# Altium schematic sheet Power_Distribution_2021_5V.SchDoc
size A; SheetNumber: 4; SheetTotal: 4
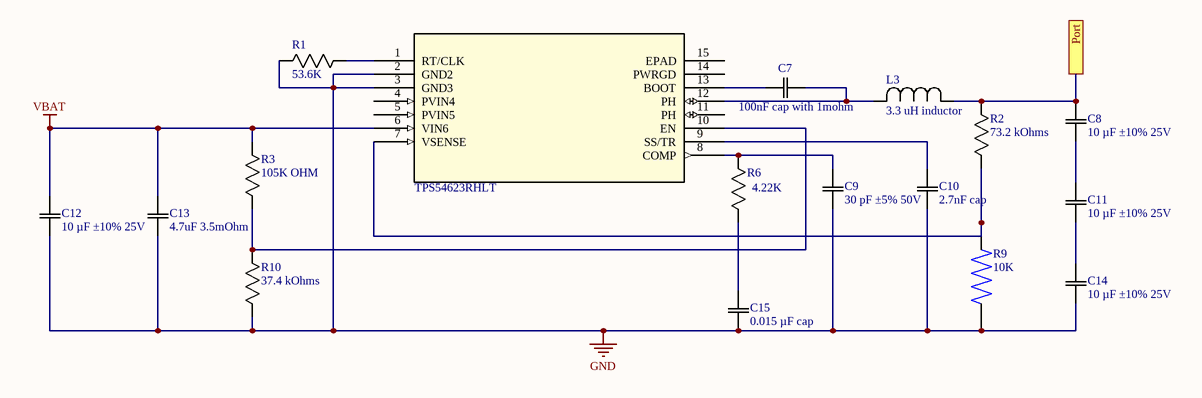
[diagram p0: Power_Distribution_2021_5V.SchDoc]

## Parts
*  TPS54623RHLT
C7  100nF cap with 1mohm
C8  10 µF ±10% 25V
C9  30 pF ±5% 50V
C10  2.7nF cap
C11  10 µF ±10% 25V
C12  10 µF ±10% 25V
C13  4.7uF 3.5mOhm
C14  10 µF ±10% 25V
C15  0.015 µF cap
L3  3.3 uH inductor
R1  53.6K
R2  73.2 kOhms
R3  105K OHM
R6  4.22K
R9  10K  [RESC3216X65N]
R10  37.4 kOhms

## Ports
Port

## Nets
GND: *.2(GND2) *.3(GND3) C9.1 C10.1 C12.1 C13.1 C14.1 C15.1 R1.1 R9.1 R10.2
VBAT: *.6(VIN6) C12.2 C13.2 R3.1
Port: C8.2 L3.1 R2.1 ; port Port
Net*_1: *.1(RT/CLK) R1.2
Net*_7: *.7(VSENSE) R2.2 R9.2
Net*_8: *.8(COMP) C9.2 R6.1
Net*_9: *.9(SS/TR) C10.2
Net*_10: *.10(EN) R3.2 R10.1
Net*_12: *.12(PH) C7.2 L3.2
Net*_13: *.13(BOOT) C7.1
NetC8_1: C8.1 C11.2
NetC11_1: C11.1 C14.2
NetC15_2: C15.2 R6.2

Not connected (* = marked no-connect by the designer): * 4(PVIN4) 5(PVIN5) 11(PH) 14(PWRGD) 15(EPAD)

## Library data of the parts
* = TPS54623RHLT: Conv DC-DC 4.5V to 17V Synchronous Step Down Single-Out 0.6V to 15V 6A 14-Pin VQFN EP T/R; Manufacturer: Texas Instruments; Switching Frequency: 1.6MHz; Number of Outputs: 1; Synchronous Rectifier: Yes; Min Output Voltage: 600mV; Quiescent Current: 250uA; Output Type: Adjustable; Supplier 1: Digi-Key; Manufacturer Part Number: TPS54623RHLT; RoHS: Yes; Category: Voltage Regulators - Switching; Pricing 1: 1=4.23000, 10=3.79900, 25=3.59200, 100=3.11290 (USD); Mount: Surface Mount; Case/Package: VQFN; Number of Pins: 14; Min Operating Temperature: -40°C; Max Operating Temperature: 150°C; Output Voltage: 15V; Output Current: 6A; Max Input Voltage: 17V; Min Input Voltage: 4.5V; Packaging: Tape and Reel; Package Quantity: 1; Max Output Current: 6A; Max Output Voltage: 15V; Operating Supply Voltage: 17V; Series: SWIFT™; Length: 3.65mm; Width: 3.65mm; Height: 0.95mm; Radiation Hardening: No; REACH SVHC: No SVHC; Lead Free: Lead Free; RoHS Compliant: Yes; ComponentLink1URL: https://datasheet.ciiva.com/2026/tps54623-2026704.pdf?src-supplier=Digi-Key; ComponentLink1Description: https://datasheet.ciiva.com/2026/tps54623-2026704.pdf?src-supplier=Digi-Key; ComponentLink2URL: https://datasheet.ciiva.com/25627/0900766b810d1a6a-25627230.pdf?src-supplier=RSComponents; ComponentLink2Description: https://datasheet.ciiva.com/25627/0900766b810d1a6a-25627230.pdf?src-supplier=RSComponents; ComponentLink3URL: https://datasheet.ciiva.com/7462/1496171-7462267.pdf?src-supplier=Newark; ComponentLink3Description: https://datasheet.ciiva.com/7462/1496171-7462267.pdf?src-supplier=Newark; ComponentLink4URL: https://datasheet.ciiva.com/2026/tps54623-2026702.pdf?src-supplier=Digi-Key; ComponentLink4Description: https://datasheet.ciiva.com/2026/tps54623-2026702.pdf?src-supplier=Digi-Key; ComponentLink5URL: https://datasheet.ciiva.com/2026/tps54623-2026703.pdf?src-supplier=Digi-Key; ComponentLink5Description: https://datasheet.ciiva.com/2026/tps54623-2026703.pdf?src-supplier=Digi-Key; ComponentLink6URL: https://datasheet.ciiva.com/7993/1882170-7993893.pdf?src-supplier=Element14; ComponentLink6Description: https://datasheet.ciiva.com/7993/1882170-7993893.pdf?src-supplier=Element14; Supplier Part Number 1: 296-29679-1-ND
C7 = C0603C104Z3VACTU: KEMET - C0603C104Z3VACTU - Multilayer Ceramic Capacitor, C Series, 0.1 - F, +80%, -20%, Y5V, 25 V, 0603 [1608 Metric] RoHS Compliant: Yes; Tolerance: 80%; Voltage Rating: 25V; Dissipation Factor: 7%; Supplier 1: Digi-Key; Manufacturer: KEMET; Manufacturer Part Number: C0603C104Z3VACTU; RoHS: Yes; Category: Ceramic Capacitors; Stock 1: 811115; Pricing 1: 1=0.10000, 10=0.02900, 50=0.01580, 100=0.01300, 500=0.00926, 1000=0.00727 (USD); Mount: Surface Mount,PCB; Case/Package: 0603; Number of Pins: 2; Case Code (Metric): 1608; Case Code (Imperial): 0603; Dielectric Material: Ceramic; Min Operating Temperature: -30°C; Max Operating Temperature: 85°C; Capacitance: 100nF; Packaging: Tape and Reel; Voltage Rating (DC): 25V; Package Quantity: 1; Dielectric: Y5V; Termination: SMD/SMT; Voltage: 25V; Series: C; Construction: Flat; Length: 1.6mm; Width: 0.031inch; Height: 0.8mm; Thickness: 0.034inch; Lead Pitch: 0.7mm; Depth: 0.8mm; Radiation Hardening: No; REACH SVHC: No SVHC; Lead Free: Lead Free; RoHS Compliant: Yes; ComponentLink1URL: https://datasheet.ciiva.com/46443/1828802-46443708.pdf?src-supplier=Element14; ComponentLink1Description: https://datasheet.ciiva.com/46443/1828802-46443708.pdf?src-supplier=Element14; ComponentLink2URL: https://datasheet.ciiva.com/46443/1828802-46443709.pdf?src-supplier=Element14; ComponentLink2Description: https://datasheet.ciiva.com/46443/1828802-46443709.pdf?src-supplier=Element14; ComponentLink3URL: https://datasheet.ciiva.com/7823/1470417-7823994.pdf?src-supplier=Element14; ComponentLink3Description: https://datasheet.ciiva.com/7823/1470417-7823994.pdf?src-supplier=Element14; Supplier Part Number 1: 399-1100-1-ND
C8 C11 C12 C14 = GRM31CR71E106KA12L: MURATA - GRM31CR71E106KA12L - SMD Multilayer Ceramic Capacitor, 10 µF, 25 V, 1206 [3216 Metric], ± 10%, X7R, GRM Series; Capacitance: 10uF; Supplier 1: Digi-Key; Manufacturer: Murata; Manufacturer Part Number: GRM31CR71E106KA12L; RoHS: Yes; Category: Ceramic Capacitors; Stock 1: 156029; Pricing 1: 1=0.70000, 10=0.51300, 50=0.41020, 100=0.35160, 500=0.27838, 1000=0.23443 (USD); Mount: Surface Mount; Case/Package: 1206; Number of Pins: 2; Case Code (Imperial): 1206; Case Code (Metric): 3216; Material: Ceramic; Min Operating Temperature: -55°C; Max Operating Temperature: 125°C; Tolerance: 10%; Dielectric: X7R; Voltage Rating: 25V; Voltage Rating (DC): 25V; Packaging: Tape and Reel; Package Quantity: 1; Termination: SMD/SMT; Voltage: 25V; Series: GRM; Construction: Flat; Length: 3.2mm; Width: 1.6mm; Height: 1.6mm; Thickness: 0.071inch; Depth: 1.6mm; Radiation Hardening: No; REACH SVHC: No SVHC; Lead Free: Lead Free; RoHS Compliant: Yes; ComponentLink1URL: https://datasheet.ciiva.com/5418/product-5418961.pdf?src-supplier=Mouser; ComponentLink1Description: https://datasheet.ciiva.com/5418/product-5418961.pdf?src-supplier=Mouser; ComponentLink2URL: https://datasheet.ciiva.com/3777/4378grm31cr71e106ka1223-3777275.pdf?src-supplier=Arrow+Electronics; ComponentLink2Description: https://datasheet.ciiva.com/3777/4378grm31cr71e106ka1223-3777275.pdf?src-supplier=Arrow+Electronics; ComponentLink3URL: https://datasheet.ciiva.com/22746/415311-22746465.pdf?src-supplier=Element14; ComponentLink3Description: https://datasheet.ciiva.com/22746/415311-22746465.pdf?src-supplier=Element14; ComponentLink4URL: https://datasheet.ciiva.com/11789/0900766b80ef921d-11789064.pdf?src-supplier=RSComponents; ComponentLink4Description: https://datasheet.ciiva.com/11789/0900766b80ef921d-11789064.pdf?src-supplier=RSComponents; ComponentLink5URL: https://datasheet.ciiva.com/22703/1747484-22703378.pdf?src-supplier=Element14; ComponentLink5Description: https://datasheet.ciiva.com/22703/1747484-22703378.pdf?src-supplier=Element14; ComponentLink6URL: https://datasheet.ciiva.com/29199/454935-da-01-en-vs-kondensator-1206-29199424.pdf?src-supplier=Conrad; ComponentLink6Description: https://datasheet.ciiva.com/29199/454935-da-01-en-vs-kondensator-1206-29199424.pdf?src-supplier=Conrad; ComponentLink7URL: https://datasheet.ciiva.com/29202/451104-da-01-de-vs-chip-kond-1206-10-0-uf-10pr-25-0v-x7r-29202596.pdf?src-supplier=Conrad; ComponentLink7Description: https://datasheet.ciiva.com/29202/451104-da-01-de-vs-chip-kond-1206-10-0-uf-10pr-25-0v-x7r-29202596.pdf?src-supplier=Conrad; ComponentLink8URL: https://datasheet.ciiva.com/22774/415311-22774043.pdf?src-supplier=Farnell; ComponentLink8Description: https://datasheet.ciiva.com/22774/415311-22774043.pdf?src-supplier=Farnell; ComponentLink9URL: https://datasheet.ciiva.com/22774/415311-22774044.pdf?src-supplier=Farnell; ComponentLink9Description: https://datasheet.ciiva.com/22774/415311-22774044.pdf?src-supplier=Farnell; ComponentLink10URL: https://datasheet.ciiva.com/6264/partnumbering-e-01-6264458.pdf?src-supplier=Digi-Key; ComponentLink10Description: https://datasheet.ciiva.com/6264/partnumbering-e-01-6264458.pdf?src-supplier=Digi-Key; ComponentLink11URL: https://datasheet.ciiva.com/6264/partnumbering-e-01-6264460.pdf?src-supplier=Digi-Key; ComponentLink11Description: https://datasheet.ciiva.com/6264/partnumbering-e-01-6264460.pdf?src-supplier=Digi-Key; ComponentLink12URL: https://datasheet.ciiva.com/6264/partnumbering-e-01-6264462.pdf?src-supplier=Digi-Key; ComponentLink12Description: https://datasheet.ciiva.com/6264/partnumbering-e-01-6264462.pdf?src-supplier=Digi-Key; ComponentLink13URL: https://datasheet.ciiva.com/16210/partnumbering-e-01-16210776.pdf?src-supplier=Future+Electronics; ComponentLink13Description: https://datasheet.ciiva.com/16210/partnumbering-e-01-16210776.pdf?src-supplier=Future+Electronics; ComponentLink14URL: https://datasheet.ciiva.com/14116/grmseries-highdielectrictype-eng-14116377.pdf?src-supplier=Distrelec; ComponentLink14Description: https://datasheet.ciiva.com/14116/grmseries-highdielectrictype-eng-14116377.pdf?src-supplier=Distrelec; Supplier Part Number 1: 490-6518-1-ND
C9 = CL21C300JBANNNC: Cap Ceramic 30pF 50V C0G 5% Pad SMD 0805 125C T/R; Manufacturer: Samsung; Temperature Coefficient: 300ppm/°C; Supplier 1: Digi-Key; Manufacturer Part Number: CL21C300JBANNNC; RoHS: Yes; Category: Ceramic Capacitors; Stock 1: 76739; Pricing 1: 1=0.10000, 10=0.04800, 50=0.02600, 100=0.02120, 500=0.01512, 1000=0.01188 (USD); Mount: Surface Mount; Case/Package: 0805; Case Code (Metric): 2012; Case Code (Imperial): 0805; Min Operating Temperature: -55°C; Max Operating Temperature: 125°C; Capacitance: 30pF; Tolerance: 5%; Dielectric: C0G; Package Quantity: 1; Packaging: Tape and Reel; Voltage Rating: 50V; Voltage: 50V; Series: CL; Construction: Flat; Length: 2mm; Width: 0.049inch; Height: 0.65mm; Depth: 1.25mm; Thickness: 0.03inch; Radiation Hardening: No; RoHS Compliant: Yes; ComponentLink1URL: https://datasheet.ciiva.com/26878/getdatasheetpartid-664450-26878150.pdf?src-supplier=Verical; ComponentLink1Description: https://datasheet.ciiva.com/26878/getdatasheetpartid-664450-26878150.pdf?src-supplier=Verical; ComponentLink2URL: https://datasheet.ciiva.com/16428/cl21c020bbannnc-16428903.pdf?src-supplier=Future+Electronics; ComponentLink2Description: https://datasheet.ciiva.com/16428/cl21c020bbannnc-16428903.pdf?src-supplier=Future+Electronics; Supplier Part Number 1: 1276-1130-1-ND
C10 = C2012C0G1H272J060AA: Cap Ceramic 0.0027uF 50V C0G 5% SMD 0805 125C Paper T/R; Manufacturer: TDK; Temperature Coefficient: 30ppm/°C; Supplier 1: Digi-Key; Manufacturer Part Number: C2012C0G1H272J060AA; RoHS: Yes; Category: Ceramic Capacitors; Stock 1: 49370; Pricing 1: 1=0.22000, 10=0.15400, 50=0.08760, 100=0.07250, 500=0.05086, 1000=0.04210 (USD); Mount: Surface Mount; Case/Package: 0805; Case Code (Imperial): 0805; Case Code (Metric): 2012; Weight: 0.000194oz; Dielectric Material: Ceramic; Min Operating Temperature: -55°C; Max Operating Temperature: 125°C; Packaging: Tape and Reel; Capacitance: 2.7nF; Voltage Rating: 50V; Tolerance: 5%; Voltage Rating (DC): 50V; Termination: SMD/SMT; Construction: Flat; Package Quantity: 1; Dielectric: C0G; Voltage: 50V; Series: C; Length: 2mm; Width: 1.25mm; Height: 0.6mm; Thickness: 0.028inch; Depth: 1.25mm; Radiation Hardening: No; RoHS Compliant: Yes; Lead Free: Lead Free; ComponentLink1URL: https://datasheet.ciiva.com/24219/c2012c0g1h272j060aa-264945-24219106.pdf?src-supplier=Mouser; ComponentLink1Description: https://datasheet.ciiva.com/24219/c2012c0g1h272j060aa-264945-24219106.pdf?src-supplier=Mouser; ComponentLink2URL: https://datasheet.ciiva.com/11788/0900766b80c1bb00-11788104.pdf?src-supplier=RSComponents; ComponentLink2Description: https://datasheet.ciiva.com/11788/0900766b80c1bb00-11788104.pdf?src-supplier=RSComponents; ComponentLink3URL: https://datasheet.ciiva.com/26936/getdatasheetpartid-781773-26936472.pdf?src-supplier=Verical; ComponentLink3Description: https://datasheet.ciiva.com/26936/getdatasheetpartid-781773-26936472.pdf?src-supplier=Verical; ComponentLink4URL: https://datasheet.ciiva.com/6291/tdkmlcccaprange-6291704.pdf?src-supplier=Digi-Key; ComponentLink4Description: https://datasheet.ciiva.com/6291/tdkmlcccaprange-6291704.pdf?src-supplier=Digi-Key; ComponentLink5URL: https://datasheet.ciiva.com/6291/tdkmlcccaprange-6291707.pdf?src-supplier=Digi-Key; ComponentLink5Description: https://datasheet.ciiva.com/6291/tdkmlcccaprange-6291707.pdf?src-supplier=Digi-Key; ComponentLink6URL: https://datasheet.ciiva.com/6291/tdkmlcccaprange-6291710.pdf?src-supplier=Digi-Key; ComponentLink6Description: https://datasheet.ciiva.com/6291/tdkmlcccaprange-6291710.pdf?src-supplier=Digi-Key; Supplier Part Number 1: 445-7508-1-ND
C13 = GRM31CR71H475KA12L: 1206 4.7 uF 50 V ±10% Tolerance X7R SMT Multilayer Ceramic Capacitor; Manufacturer: Murata; Voltage Rating: 50V; Supplier 1: Digi-Key; Manufacturer Part Number: GRM31CR71H475KA12L; RoHS: Yes; Category: Ceramic Capacitors; Stock 1: 47542; Pricing 1: 1=0.46000, 10=0.31700, 50=0.22160, 100=0.19000, 500=0.14250, 1000=0.12033 (USD); Mount: Surface Mount; Case/Package: 1206; Case Code (Metric): 3216; Case Code (Imperial): 1206; Material: Ceramic; Min Operating Temperature: -55°C; Max Operating Temperature: 125°C; Capacitance: 4.7uF; Tolerance: 10%; Dielectric: X7R; Packaging: Tape and Reel; Voltage Rating (DC): 50V; Package Quantity: 2000; Termination: SMD/SMT; Voltage: 50V; Series: GRM; Construction: Flat; Length: 3.2mm; Width: 0.063inch; Height: 1.6mm; Thickness: 0.071inch; Depth: 1.6mm; Radiation Hardening: No; REACH SVHC: No SVHC; Lead Free: Lead Free; RoHS Compliant: Yes; ComponentLink1URL: https://datasheet.ciiva.com/6072/415379-6072784.pdf?src-supplier=Farnell; ComponentLink1Description: https://datasheet.ciiva.com/6072/415379-6072784.pdf?src-supplier=Farnell; ComponentLink2URL: https://datasheet.ciiva.com/3777/2267grm31cr71h475ka1223-3777241.pdf?src-supplier=Arrow+Electronics; ComponentLink2Description: https://datasheet.ciiva.com/3777/2267grm31cr71h475ka1223-3777241.pdf?src-supplier=Arrow+Electronics; ComponentLink3URL: https://datasheet.ciiva.com/29202/451279-da-01-de-vs-kondens-grm31-cr71h-475ka12l-29202365.pdf?src-supplier=Conrad; ComponentLink3Description: https://datasheet.ciiva.com/29202/451279-da-01-de-vs-kondens-grm31-cr71h-475ka12l-29202365.pdf?src-supplier=Conrad; ComponentLink4URL: https://datasheet.ciiva.com/29202/450972-da-01-de-vs-chip-kond-1206-4-7-uf-10pr-50-0v-x7r-29202576.pdf?src-supplier=Conrad; ComponentLink4Description: https://datasheet.ciiva.com/29202/450972-da-01-de-vs-chip-kond-1206-4-7-uf-10pr-50-0v-x7r-29202576.pdf?src-supplier=Conrad; ComponentLink5URL: https://datasheet.ciiva.com/6270/partnumbering-e-01-6270217.pdf?src-supplier=Digi-Key; ComponentLink5Description: https://datasheet.ciiva.com/6270/partnumbering-e-01-6270217.pdf?src-supplier=Digi-Key; ComponentLink6URL: https://datasheet.ciiva.com/6270/partnumbering-e-01-6270218.pdf?src-supplier=Digi-Key; ComponentLink6Description: https://datasheet.ciiva.com/6270/partnumbering-e-01-6270218.pdf?src-supplier=Digi-Key; ComponentLink7URL: https://datasheet.ciiva.com/6270/partnumbering-e-01-6270219.pdf?src-supplier=Digi-Key; ComponentLink7Description: https://datasheet.ciiva.com/6270/partnumbering-e-01-6270219.pdf?src-supplier=Digi-Key; ComponentLink8URL: https://datasheet.ciiva.com/7937/415310-7937749.pdf?src-supplier=Element14; ComponentLink8Description: https://datasheet.ciiva.com/7937/415310-7937749.pdf?src-supplier=Element14; Supplier Part Number 1: 490-6521-1-ND
C15 = CGA4F2C0G1H153J085AA: SMD Multilayer Ceramic Capacitor, CGA Series, 0.015 F, 5%, C0G / NP0, 50 V, 0805 [2012 Metric] ;RoHS Compliant: Yes; Manufacturer: TDK; Capacitance: 15nF; Voltage Rating: 50V; Supplier 1: Digi-Key; Manufacturer Part Number: CGA4F2C0G1H153J085AA; RoHS: Yes; Category: Ceramic Capacitors; Stock 1: 17898; Pricing 1: 1=0.32000, 10=0.22000, 50=0.15400, 100=0.13200, 500=0.09900, 1000=0.08360 (USD); Mount: Surface Mount; Case/Package: 0805; Case Code (Metric): 2012; Case Code (Imperial): 0805; Weight: 0.000194oz; Min Operating Temperature: -55°C; Max Operating Temperature: 125°C; Tolerance: 5%; Packaging: Tape and Reel; Voltage Rating (DC): 50V; Dielectric: C0G; Termination: SMD/SMT; Series: CGA; Package Quantity: 1; Resistor Type: Ceramic; Length: 2mm; Width: 0.049inch; Height: 0.85mm; Depth: 1.25mm; Thickness: 0.037inch; Ratings: AEC-Q200; Lead Free: Lead Free; REACH SVHC: No SVHC; RoHS Compliant: Yes; ComponentLink1URL: https://datasheet.ciiva.com/24218/cga4f2c0g1h153j085aa-265904-24218633.pdf?src-supplier=Mouser; ComponentLink1Description: https://datasheet.ciiva.com/24218/cga4f2c0g1h153j085aa-265904-24218633.pdf?src-supplier=Mouser; ComponentLink2URL: https://datasheet.ciiva.com/7975/1807242-7975403.pdf?src-supplier=Element14; ComponentLink2Description: https://datasheet.ciiva.com/7975/1807242-7975403.pdf?src-supplier=Element14; Supplier Part Number 1: 445-6948-1-ND
L3 = IHLP4040DZER3R3M01: Inductor High Current Shielded Wirewound 3.3uH 20% 100KHz 10A 11.8mOhm DCR 4040 T/R; Manufacturer: Vishay Dale; Core Material: Metal,Composite,Ferrite; DC Resistance (DCR): 11.8mR; Saturation Current: 18.6A; Self Resonant Frequency: 5MHz; Supplier 1: Digi-Key; Manufacturer Part Number: IHLP4040DZER3R3M01; RoHS: Yes; Category: Fixed Inductors; Stock 1: 19683; Pricing 1: 1=1.58000, 10=1.46600, 25=1.35280, 50=1.12760, 100=1.05980, 250=0.94712 (USD); Mount: Surface Mount; Case/Package: 4040; Number of Pins: 4040; Weight: 0.070548oz; Case Code (Imperial): 4040; Contact Plating: Tin; Min Operating Temperature: -55°C; Max Operating Temperature: 125°C; Inductance: 3.3uH; Tolerance: 20%; Packaging: Tape and Reel; Shielding: Shielded; Package Quantity: 500; Current Rating: 10A; Inductance Tolerance: 20%; Test Frequency: 100kHz; Max DC Current: 18.6A; Termination: SMD/SMT; RMS Current (Irms): 10A; Series: IHLP-4040DZ-01; Rated Current-Max: 10A; Length: 0.43inch; Width: 0.405inch; Height: 4mm; Depth: 10.3mm; Height - Seated (Max): 0.157inch; Radiation Hardening: No; REACH SVHC: Unknown; Military Standard: Not; Lead Free: Lead Free; RoHS Compliant: Yes; ComponentLink1URL: https://datasheet.ciiva.com/5706/485035-5706841.pdf?src-supplier=Farnell; ComponentLink1Description: https://datasheet.ciiva.com/5706/485035-5706841.pdf?src-supplier=Farnell; ComponentLink2URL: https://datasheet.ciiva.com/16292/ihlp4040dzer3r3m01-16292129.pdf?src-supplier=Future+Electronics; ComponentLink2Description: https://datasheet.ciiva.com/16292/ihlp4040dzer3r3m01-16292129.pdf?src-supplier=Future+Electronics; ComponentLink3URL: https://datasheet.ciiva.com/15160/getdatasheetpartid-160911-15160590.pdf?src-supplier=Verical; ComponentLink3Description: https://datasheet.ciiva.com/15160/getdatasheetpartid-160911-15160590.pdf?src-supplier=Verical; ComponentLink4URL: https://datasheet.ciiva.com/3082/lp40dz01-3082015.pdf?src-supplier=Avnet; ComponentLink4Description: https://datasheet.ciiva.com/3082/lp40dz01-3082015.pdf?src-supplier=Avnet; ComponentLink5URL: https://datasheet.ciiva.com/3082/lp40dz01-3082016.pdf?src-supplier=Avnet; ComponentLink5Description: https://datasheet.ciiva.com/3082/lp40dz01-3082016.pdf?src-supplier=Avnet; ComponentLink6URL: https://datasheet.ciiva.com/17269/lp40dz01-17269286.pdf?src-supplier=Avnet+Europe; ComponentLink6Description: https://datasheet.ciiva.com/17269/lp40dz01-17269286.pdf?src-supplier=Avnet+Europe; ComponentLink7URL: https://datasheet.ciiva.com/8017/485035-8017357.pdf?src-supplier=Element14; ComponentLink7Description: https://datasheet.ciiva.com/8017/485035-8017357.pdf?src-supplier=Element14; ComponentLink8URL: https://datasheet.ciiva.com/8017/485035-8017359.pdf?src-supplier=Element14; ComponentLink8Description: https://datasheet.ciiva.com/8017/485035-8017359.pdf?src-supplier=Element14; Supplier Part Number 1: 541-1298-1-ND
R1 = RC0603FR-0753K6L: Res Thick Film 0603 53.6K Ohm 1% 0.1W(1/10W) ±100ppm/°C Pad SMD T/R; Manufacturer: Yageo; Resistance: 53.6kR; Voltage Rating (DC): 50V; Power Rating: 100mW; Supplier 1: Digi-Key; Manufacturer Part Number: RC0603FR-0753K6L; RoHS: Yes; Category: Chip SMD Resistors; Stock 1: 3047; Pricing 1: 1=0.10000, 10=0.02400, 100=0.00970, 1000=0.00436, 2500=0.00378 (USD); Mount: Surface Mount; Case/Package: 0603; Case Code (Imperial): 0603; Case Code (Metric): 1608; Size Code: 0603; Min Operating Temperature: -55°C; Max Operating Temperature: 155°C; Tolerance: 1%; Resistor Type: Thick Film; Temperature Coefficient: 100ppm/°C; Packaging: Tape and Reel; Voltage Rating: 50V; Termination: SMD/SMT; Features: Moisture Resistant; Series: RC; Max Power Dissipation: 100mW; Number of Terminations: 2; Construction: Rectangular; Technology: THICK FILM; Length: 1.6mm; Height: 0.45mm; Depth: 0.8mm; Lead Free: Lead Free; Military Standard: Not; RoHS Compliant: Yes; ComponentLink1URL: https://datasheet.ciiva.com/11819/0900766b80f96399-11819394.pdf?src-supplier=RSComponents; ComponentLink1Description: https://datasheet.ciiva.com/11819/0900766b80f96399-11819394.pdf?src-supplier=RSComponents; Supplier Part Number 1: 311-53.6KHRCT-ND
R2 = RC0603FR-0773K2L: YAGEO - RC0603FR-0773K2L - Resistor; Tolerance: 1%; Resistance: 73.2kR; Temperature Coefficient: 100ppm/°C; Power Rating: 100mW; Voltage Rating: 50V; Supplier 1: Digi-Key; Manufacturer: Yageo; Manufacturer Part Number: RC0603FR-0773K2L; RoHS: Yes; Category: Chip SMD Resistors; Stock 1: 2716; Pricing 1: 1=0.10000, 10=0.02400, 100=0.00970, 1000=0.00436, 2500=0.00378 (USD); Case/Package: 0603; Contact Plating: Tin,Matte; Case Code (Imperial): 0603; Case Code (Metric): 1608; Size Code: 0603; Min Operating Temperature: -55°C; Max Operating Temperature: 155°C; Resistor Type: Thick Film; Packaging: Tape and Reel; Termination: SMD/SMT; Voltage Rating (DC): 50V; Features: Moisture Resistant; Series: RC; Max Power Dissipation: 100mW; Number of Terminations: 2; Construction: Rectangular; Length: 1.6mm; Width: 0.8mm; Height: 0.45mm; Depth: 0.8mm; Military Standard: Not; Lead Free: Lead Free; RoHS Compliant: Yes; ComponentLink1URL: https://datasheet.ciiva.com/8888/pyu-rc0603-51-rohs-l-4-8888325.pdf?src-supplier=Avnet; ComponentLink1Description: https://datasheet.ciiva.com/8888/pyu-rc0603-51-rohs-l-4-8888325.pdf?src-supplier=Avnet; ComponentLink2URL: https://datasheet.ciiva.com/28397/pyu-rc0603-51-rohs-l-4-28397125.pdf?src-supplier=Avnet+Europe; ComponentLink2Description: https://datasheet.ciiva.com/28397/pyu-rc0603-51-rohs-l-4-28397125.pdf?src-supplier=Avnet+Europe; Supplier Part Number 1: 311-73.2KHRCT-ND
R3 = RC0603FR-07105KL: Thick Film Resistors 105K OHM 1%; Manufacturer: Yageo; Resistance: 105kR; Power Rating: 100mW; Voltage Rating: 75V; Temperature Coefficient: 100ppm/°C; Voltage Rating (DC): 50V; Supplier 1: Digi-Key; Manufacturer Part Number: RC0603FR-07105KL; RoHS: Yes; Category: Chip SMD Resistors; Stock 1: 220613; Pricing 1: 1=0.10000, 10=0.02400, 100=0.00970, 1000=0.00436, 2500=0.00378 (USD); Mount: Surface Mount; Case/Package: 0603; Case Code (Metric): 1608; Case Code (Imperial): 0603; Weight: 7.1E-05oz; Size Code: 0603; Min Operating Temperature: -55°C; Max Operating Temperature: 155°C; Tolerance: 1%; Packaging: Tape and Reel; Package Quantity: 1; Resistor Type: Thick Film; Number of Terminations: 2; Termination: SMD/SMT; Max Power Dissipation: 100mW; Features: Moisture Resistant; Series: RC; Construction: Rectangular; Technology: THICK FILM; Length: 1.6mm; Width: 0.031inch; Height: 0.45mm; Depth: 0.8mm; Military Standard: Not; Lead Free: Lead Free; RoHS Compliant: Yes; ComponentLink1URL: https://datasheet.ciiva.com/11819/0900766b80f96399-11819228.pdf?src-supplier=RSComponents; ComponentLink1Description: https://datasheet.ciiva.com/11819/0900766b80f96399-11819228.pdf?src-supplier=RSComponents; ComponentLink2URL: https://datasheet.ciiva.com/2455/pyu-r-int-thick-7-2455239.pdf?src-supplier=Digi-Key; ComponentLink2Description: https://datasheet.ciiva.com/2455/pyu-r-int-thick-7-2455239.pdf?src-supplier=Digi-Key; ComponentLink3URL: https://datasheet.ciiva.com/2455/pyu-r-int-thick-7-2455240.pdf?src-supplier=Digi-Key; ComponentLink3Description: https://datasheet.ciiva.com/2455/pyu-r-int-thick-7-2455240.pdf?src-supplier=Digi-Key; ComponentLink4URL: https://datasheet.ciiva.com/2455/pyu-r-int-thick-7-2455241.pdf?src-supplier=Digi-Key; ComponentLink4Description: https://datasheet.ciiva.com/2455/pyu-r-int-thick-7-2455241.pdf?src-supplier=Digi-Key; Supplier Part Number 1: 311-105KHRCT-ND
R6 = RC0603FR-074K22L: Resistor;Resistance:4K22ohm;Resistance Tolerance:± 1%;Resistor Element Material:Thick Film;Resistor Case Style:0603; Manufacturer: Yageo; Resistance: 4.22kR; Power Rating: 100mW; Temperature Coefficient: 100ppm/°C; Voltage Rating: 50V; Working Voltage: 75V; Supplier 1: Digi-Key; Manufacturer Part Number: RC0603FR-074K22L; RoHS: Yes; Category: Chip SMD Resistors; Stock 1: 44107; Pricing 1: 1=0.10000, 10=0.02400, 100=0.00970, 1000=0.00436, 2500=0.00378 (USD); Case/Package: 0603; Case Code (Metric): 1608; Case Code (Imperial): 0603; Min Operating Temperature: -55°C; Max Operating Temperature: 155°C; Tolerance: 1%; Series: RC; Technology: METAL OXIDE FILM; Package Quantity: 1; Packaging: Tape and Reel; Resistor Type: Thick Film; Number of Terminations: 2; Termination: SMD/SMT; Max Power Dissipation: 100mW; Voltage Rating (DC): 50V; Features: Moisture Resistant; Construction: Rectangular; Length: 1.6mm; Width: 0.031inch; Height: 0.022inch; Depth: 0.8mm; RoHS Compliant: Yes; Military Standard: Not; Lead Free: Lead Free; ComponentLink1URL: https://datasheet.ciiva.com/2454/pyu-r-int-thick-7-2454435.pdf?src-supplier=Digi-Key; ComponentLink1Description: https://datasheet.ciiva.com/2454/pyu-r-int-thick-7-2454435.pdf?src-supplier=Digi-Key; ComponentLink2URL: https://datasheet.ciiva.com/2454/pyu-r-int-thick-7-2454436.pdf?src-supplier=Digi-Key; ComponentLink2Description: https://datasheet.ciiva.com/2454/pyu-r-int-thick-7-2454436.pdf?src-supplier=Digi-Key; ComponentLink3URL: https://datasheet.ciiva.com/2454/pyu-r-int-thick-7-2454437.pdf?src-supplier=Digi-Key; ComponentLink3Description: https://datasheet.ciiva.com/2454/pyu-r-int-thick-7-2454437.pdf?src-supplier=Digi-Key; ComponentLink4URL: https://datasheet.ciiva.com/15189/getdatasheetpartid-32804-15189754.pdf?src-supplier=Verical; ComponentLink4Description: https://datasheet.ciiva.com/15189/getdatasheetpartid-32804-15189754.pdf?src-supplier=Verical; Supplier Part Number 1: 311-4.22KHRCT-ND
R9 = TNPW120610K0BETA: Res Thin Film 1206 10K Ohm 0.1% 0.25W(1/4W) ?25ppm/C Molded SMD T/R; Package: None; Price: None; Value: *; MP: TNPW120610K0BETA; Availability: Unavailable
R10 = RC0603FR-0737K4L: YAGEO - RC0603FR-0737K4L - Resistor; Resistance: 37.4kR; Power Rating: 100mW; Tolerance: 1%; Voltage Rating: 50V; Temperature Coefficient: 100ppm/°C; Supplier 1: Digi-Key; Manufacturer: Yageo; Manufacturer Part Number: RC0603FR-0737K4L; RoHS: Yes; Category: Chip SMD Resistors; Pricing 1: 1=0.10000, 10=0.02400, 100=0.00970, 1000=0.00436, 2500=0.00378 (USD); Case/Package: 0603; Case Code (Metric): 1608; Case Code (Imperial): 0603; Size Code: 0603; Min Operating Temperature: -55°C; Max Operating Temperature: 155°C; Package Quantity: 1; Packaging: Tape and Reel; Resistor Type: Thick Film; Number of Terminations: 2; Termination: SMD/SMT; Max Power Dissipation: 100mW; Voltage Rating (DC): 50V; Features: Moisture Resistant; Series: RC; Construction: Rectangular; Length: 0.063inch; Width: 0.031inch; Height: 0.022inch; Depth: 0.8mm; Military Standard: Not; Lead Free: Lead Free; RoHS Compliant: Yes; ComponentLink1URL: https://datasheet.ciiva.com/2455/pyu-r-int-thick-7-2455137.pdf?src-supplier=Digi-Key; ComponentLink1Description: https://datasheet.ciiva.com/2455/pyu-r-int-thick-7-2455137.pdf?src-supplier=Digi-Key; ComponentLink2URL: https://datasheet.ciiva.com/2455/pyu-r-int-thick-7-2455138.pdf?src-supplier=Digi-Key; ComponentLink2Description: https://datasheet.ciiva.com/2455/pyu-r-int-thick-7-2455138.pdf?src-supplier=Digi-Key; ComponentLink3URL: https://datasheet.ciiva.com/2455/pyu-r-int-thick-7-2455139.pdf?src-supplier=Digi-Key; ComponentLink3Description: https://datasheet.ciiva.com/2455/pyu-r-int-thick-7-2455139.pdf?src-supplier=Digi-Key; Supplier Part Number 1: 311-37.4KHRCT-ND